# EAGLE design PHOTODIODE SENSOR 8 (EAGLE 9.6.2)
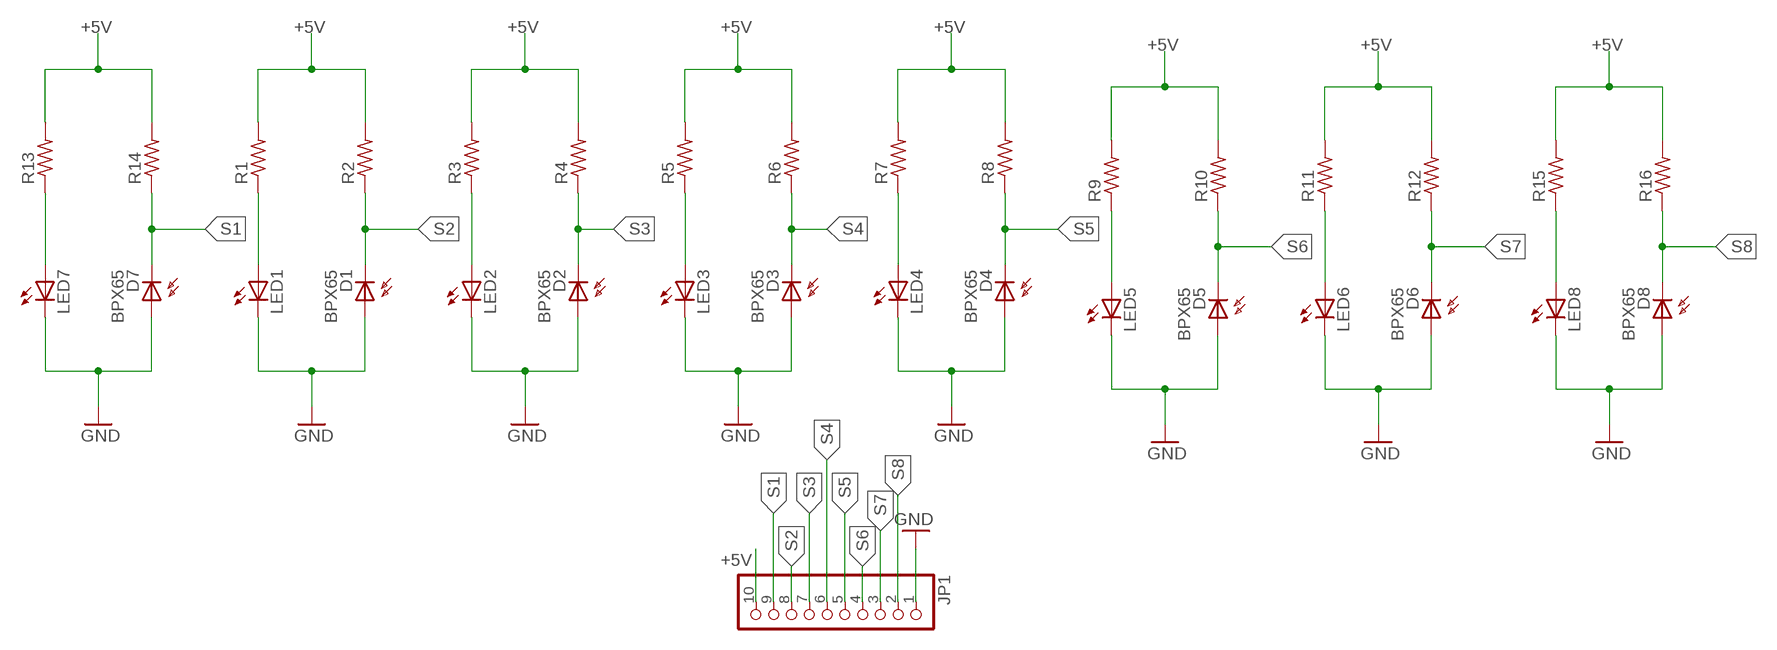
[diagram p0: schematic, sheet 1]

## Parts
D1  BPX65  [BPX65]
D2  BPX65  [BPX65]
D3  BPX65  [BPX65]
D4  BPX65  [BPX65]
D5  BPX65  [BPX65]
D6  BPX65  [BPX65]
D7  BPX65  [BPX65]
D8  BPX65  [BPX65]
JP1  PINHD-1X10  [1X10]
LED1  LED5MM  [LED5MM]
LED2  LED5MM  [LED5MM]
LED3  LED5MM  [LED5MM]
LED4  LED5MM  [LED5MM]
LED5  LED5MM  [LED5MM]
LED6  LED5MM  [LED5MM]
LED7  LED5MM  [LED5MM]
LED8  LED5MM  [LED5MM]
R1  R-US_0204/7  [0204/7]
R2  R-US_0204/7  [0204/7]
R3  R-US_0204/7  [0204/7]
R4  R-US_0204/7  [0204/7]
R5  R-US_0204/7  [0204/7]
R6  R-US_0204/7  [0204/7]
R7  R-US_0204/7  [0204/7]
R8  R-US_0204/7  [0204/7]
R9  R-US_0204/7  [0204/7]
R10  R-US_0204/7  [0204/7]
R11  R-US_0204/7  [0204/7]
R12  R-US_0204/7  [0204/7]
R13  R-US_0204/7  [0204/7]
R14  R-US_0204/7  [0204/7]
R15  R-US_0204/7  [0204/7]
R16  R-US_0204/7  [0204/7]

## Nets
+5V: JP1.10 R1.2 R2.2 R3.2 R4.2 R5.2 R6.2 R7.2 R8.2 R9.2 R10.2 R11.2 R12.2 R13.2 R14.2 R15.2 R16.2
GND: D1.A D2.A D3.A D4.A D5.A D6.A D7.A D8.A JP1.1 LED1.K(C) LED2.K(C) LED3.K(C) LED4.K(C) LED5.K(C) LED6.K(C) LED7.K(C) LED8.K(C)
N$1: LED2.A R3.1
N$2: LED3.A R5.1
N$3: LED1.A R1.1
N$4: LED4.A R7.1
N$5: LED5.A R9.1
N$6: LED6.A R11.1
N$53: LED7.A R13.1
N$54: LED8.A R15.1
S1: D7.K(C) JP1.9 R14.1
S2: D1.K(C) JP1.8 R2.1
S3: D2.K(C) JP1.7 R4.1
S4: D3.K(C) JP1.6 R6.1
S5: D4.K(C) JP1.5 R8.1
S6: D5.K(C) JP1.4 R10.1
S7: D6.K(C) JP1.3 R12.1
S8: D8.K(C) JP1.2 R16.1

## Library data of the parts
D1-D8 = opto-trans-siemens:BPX65: PHOTO DIODE; MPN: BPX65.; OC_FARNELL: 327451; OC_NEWARK: 06WX2764
JP1 = pinhead:PINHD-1X10: PIN HEADER
LED1-LED8 = led:LED: LED OSRAM: - CHIPLED LG R971, LG N971, LY N971, LG Q971, LY Q971, LO R971, LY R971 LH N974, LH R974 LS Q976, LO Q976, LY Q976 LO Q996 - Hyper CHIPLED LW Q18S LB Q993, LB Q99A, LB R99A - SideLED LS A670, LO A670, LY A670, LG A670, LP A670 LB A673, LV A673, LT A673, LW A673 LH A674 LY A675 LS A676, LA A676, LO A676, LY A676, LW A676 LS A679, LY A679, LG A679 - Hyper Micro SIDELED® LS Y876, LA Y876, LO Y876, LY Y876 LT Y87S - SmartLED LW L88C, LW L88S LB L89C, LB L89S, LG L890 LS L89K, LO L89K, LY L89K LS L896, LA L896, LO L896, LY L896 - TOPLED LS T670, LO T670, LY T670, LG T670, LP T670 LSG T670, LSP T670, LSY T670, LOP T670, LYG T670 LG T671, LOG T671, LSG T671 LB T673, LV T673, LT T673, LW T673 LH T674 LS T676, LA T676, LO T676, LY T676, LB T676, LH T676, LSB T676, LW T676 LB T67C, LV T67C, LT T67C, LS T67K, LO T67K, LY T67K, LW E67C LS E67B, LA E67B, LO E67B, LY E67B, LB E67C, LV E67C, LT E67C LW T67C LS T679, LY T679, LG T679 LS T770, LO T770, LY T770, LG T770, LP T770 LB T773, LV T773, LT T773, LW T773 LH T774 LS E675, LA E675, LY E675, LS T675 LS T776, LA T776, LO T776, LY T776, LB T776 LHGB T686 LT T68C, LB T68C - Hyper Mini TOPLED® LB M676 - Mini TOPLED Santana® LG M470 LS M47K, LO M47K, LY M47K Source: http://www.osram.convergy.de LUXEON: - LUMILED® LXK2-PW12-R00, LXK2-PW12-S00, LXK2-PW14-U00, LXK2-PW14-V00 LXK2-PM12-R00, LXK2-PM12-S00, LXK2-PM14-U00 LXK2-PE12-Q00, LXK2-PE12-R00, LXK2-PE12-S00, LXK2-PE14-T00, LXK2-PE14-U00 LXK2-PB12-K00, LXK2-PB12-L00, LXK2-PB12-M00, LXK2-PB14-N00, LXK2-PB14-P00, LXK2-PB14-Q00 LXK2-PR12-L00, LXK2-PR12-M00, LXK2-PR14-Q00, LXK2-PR14-R00 LXK2-PD12-Q00, LXK2-PD12-R00, LXK2-PD12-S00 LXK2-PH12-R00, LXK2-PH12-S00 LXK2-PL12-P00, LXK2-PL12-Q00, LXK2-PL12-R00 Source: www.luxeon.com KINGBRIGHT: KA-3528ASYC Source: www.kingbright.com
R1-R16 = rcl:R-US_: RESISTOR, American symbol; SPICEPREFIX: R

## Board
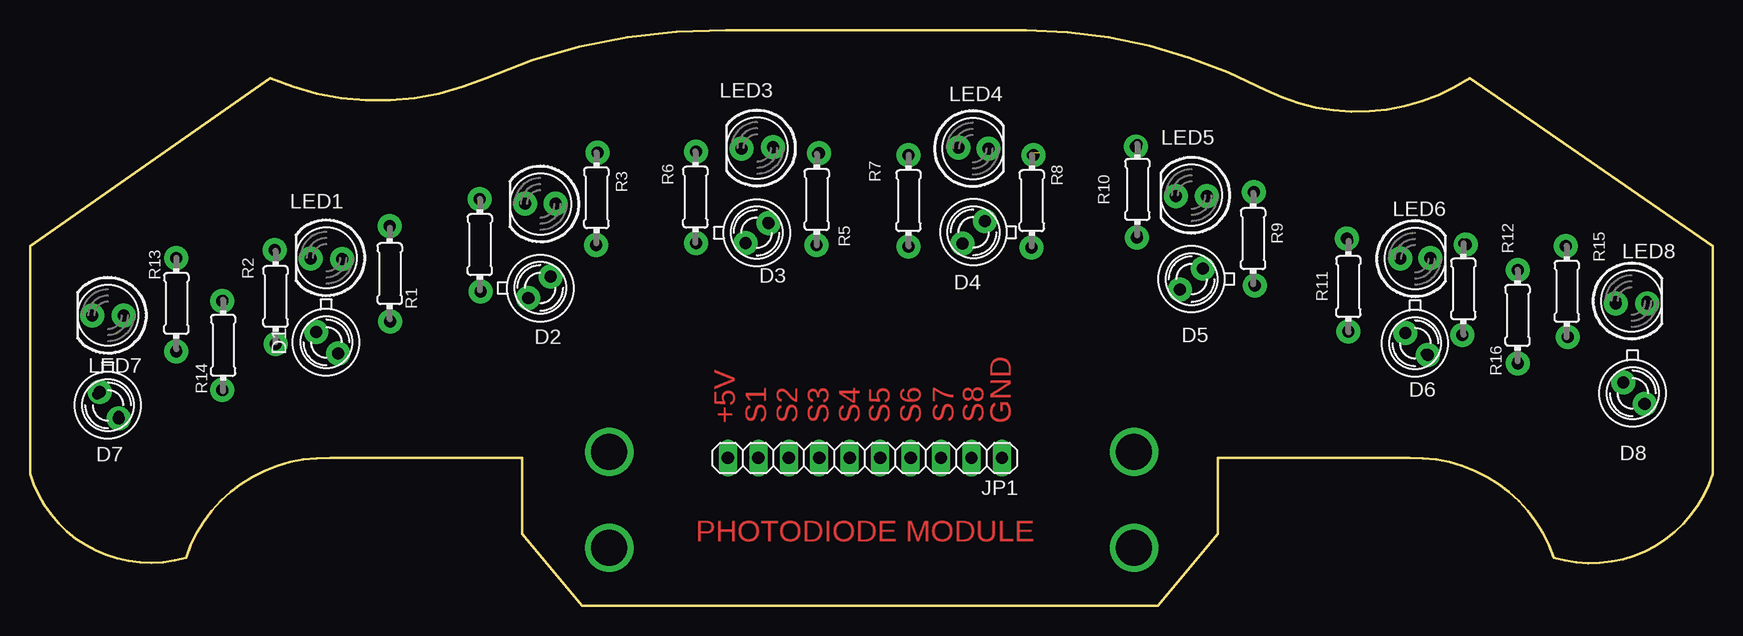
[diagram p1: board, top side]
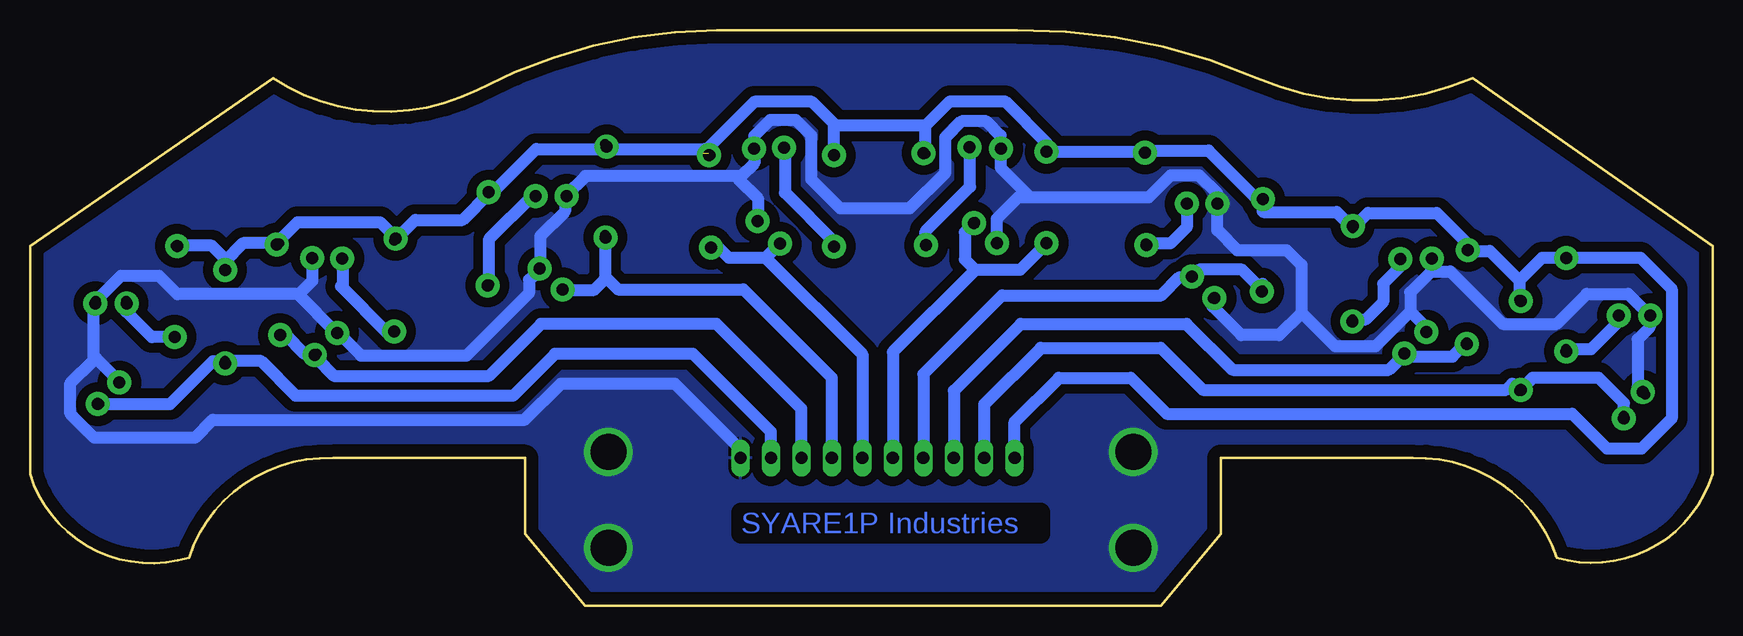
[diagram p2: board, bottom side, seen from below]

Size 140.25 x 48 mm. Coordinates in mm from the lower left corner, seen from the top.
Outline: 46,0 94,0 99,6 99,12.3 115,12.3 arc-74 127,4 arc90 140.25,11 140.25,30 120,44 arc-60 103,43 arc27 83,48 58,48 arc24 38,44 arc-48 20,44 0,30 0,11 arc90 13,4 arc-74 25,12.3 41,12.3 41,6 46,0
Copper layers (1*16): Top 0.035mm / dielectric 1.5mm / Bottom 0.035mm
Design rules "default": minimum track width 6mil, minimum drill 0.35mm, track to track 6mil, track to pad 6mil, pad to pad 6mil, via to via 6mil, smd to smd 6mil, copper to edge 40mil, drill to drill 6mil, minimum pad ring 10mil, minimum via ring 8mil, stop-mask expansion 4mil, vias tented up to drill 0mil, thermal gap 10mil

### Footprints (pad centres in the part's own frame; a part is rotated, then mirrored left to right if it is on the bottom)
BPX65 = drill 0.813 octagon: A -0.889,-0.889; K 0.889,0.889
1X10 = drill 1.016 long: 1 -11.43,0; 2 -8.89,0; 3 -6.35,0; 4 -3.81,0; 5 -1.27,0; 6 1.27,0; 7 3.81,0; 8 6.35,0; 9 8.89,0; 10 11.43,0
LED5MM = drill 0.813 octagon: A -1.27,0; K 1.27,0
0204/7 = drill 0.813 octagon: 1 -3.81,0; 2 3.81,0

### Placement (x,y rotation side)
D1  24.7,21.95 270 top
D2  42.54,26.5 0 top
D3  60.57,31.1 0 top
D4  78.64,31.11 180 top
D5  96.82,27.21 180 top
D6  115.47,21.88 270 top
D7  6.5,16.7 270 top
D8  133.6,17.7 270 top
JP1  69.6,12.3 180 top
LED1  24.71,29 180 top
LED2  42.56,33.49 180 top
LED3  60.62,38.15 180 top
LED4  78.6,38.11 0 top
LED5  96.82,34.22 180 top
LED6  115.45,28.93 0 top
LED7  6.5,24.2 180 top
LED8  133.5,25.4 0 top
R1  29.99,27.67 90 top
R2  20.47,25.77 90 top
R3  47.22,34 90 top
R4  37.5,30.1 90 top
R5  65.59,33.86 90 top
R6  55.47,34.06 90 top
R7  73.23,33.76 90 top
R8  83.51,33.76 90 top
R9  101.96,30.6 90 top
R10  92.31,34.7 90 top
R11  109.9,26.6 90 top
R12  119.48,26.4 90 top
R13  12.2,25.2 90 top
R14  16.1,21.7 90 top
R15  128.1,26.2 90 top
R16  124,24.2 90 top

### Tracks (layer width: path | path; a pad name or v marks a point on that pad's centre or on a via)
+5V  (1 unrouted)
  Bottom 1.016: R2.2 20.47,30.22 23,32.75 28.72,32.75 R1.2 31.34,32.83 37.45,32.83 37.5,32.88 R4.2 37.97,33.91 42,37.95 47.09,37.95 R3.2 47.28,37.87 R6.2 55.47,38.52 58.99,42.05 63.55,42.05 65.59,40.02 | R10.2 92.05,38.24 | 84.14,37.74 79.87,42.02 75.08,42.02 73.23,40.17 | R10.2 92.74,38.08 98.06,38.08 101.73,34.41 R9.2 104.2,32.16 108.14,32.16 R11.2 109.9,30.8 111.08,31.98 117.94,31.98 119.48,30.44 R12.2 122.48,30.21 124,28.69 R16.2 124,28.91 125.1,30.01 R15.2 | R2.2 20.3,29.58 | R7.2 72.83,37.57 | R7.2 73.23,37.77 | 83.41,37.67 R8.2 | R8.2 83.69,37.74 | 73.13,37.67 R7.2 | R7.2 73.23,40.17 | R8.2 84.01,38.07 91.87,38.07 R10.2 | R2.2 18.58,29.58 16.1,27.1 | 16.1,27.1 R14.2 | 16.1,27.1 14.19,29.01 R13.2 6.01,29.01 3.41,26.41 3.41,15.59 5.9,13.1 8.8,13.1 11.7,16 45.5,16 48.5,19 54.5,19 58.17,15.33 JP1.10 | R5.2 65.59,40.02 | 65.59,40.02 73.08,40.02 73.23,40.17
GND  (via drill 1 pad 2, 3 pad 4)
  Bottom 1.016: D1.A 23.66,22.99 25.2,24.52 | 23.44,27.86 25.2,26.11 25.2,24.52 | 23.44,27.86 LED1.K | 25.2,24.52 28.1,21.61 31.45,21.61 34.27,24.44 | 34.27,24.44 34.27,28.4 35.48,29.61 39.6,29.61 41.29,31.3 LED2.K v41.29,33.52 41.29,34.35 42.81,35.88 45.17,35.88 47.02,34.03 56.84,34.03 | D2.A 41.65,24.92 39.28,22.55 36.13,22.55 34.27,24.41 34.27,24.44 | 56.84,34.03 57.89,34.03 59.68,32.24 D3.A | 56.84,34.03 59.34,36.53 LED3.K 59.34,39.21 60.53,40.39 62.59,40.39 63.95,39.02 63.95,36.1 66.92,33.13 72.72,33.13 75.14,35.55 75.14,39.22 76.43,40.51 78.54,40.51 79.87,39.18 LED4.K 79.87,36.91 80.97,35.81 | 80.97,35.81 81.22,35.56 79.53,33.88 D4.A | 80.97,35.81 93.96,35.81 LED5.K 95.65,34.12 95.65,32.86 97.71,30.8 D5.A 98.65,27.16 98.65,26.05 103.86,20.84 112.65,20.84 D6.A 114.76,22.77 117.95,25.96 | 116.72,28.46 LED6.K 116.72,27.07 117.83,25.96 117.95,25.96 | D7.A 6.23,18.21 6.23,22.2 5.23,23.2 LED7.K 7.03,26 10.5,26 13,23.5 17.5,23.5 21.86,27.86 23.44,27.86 | 117.95,25.96 127.96,25.96 129.5,27.5 132.67,27.5 LED8.K 134.97,25.2 134.97,20.45 136.88,18.54 136.88,16 134.88,14 126.5,14 125.01,15.49 99.01,15.49 96,18.5 86.5,18.5 81.03,13.03 JP1.1 | 134.77,20.65 D8.A
  other vias: 48.29,12.81 92.04,12.81 48.29,4.81 92.04,4.81
  pour Bottom (isolate 0.813): -3.9,-3 145,-3 145,51.9 -3.9,51.9
N$1
  Bottom 1.016: LED2.A 43.83,31.56 45.2,30.19 R3.1
N$2  (via drill 1 pad 2)
  Bottom 1.016: v65.56,30.05 R5.1 65.59,31.23 61.88,34.92 LED3.A
N$3
  Bottom 1.016: LED1.A 25.98,28.32 27.45,26.85 27.45,25.32 28.91,23.86 R1.1
N$4
  Bottom 1.016: R7.1 73.23,30.33 77.33,34.43 LED4.A
N$5
  Bottom 1.016: 101.91,26.74 R9.1 101.96,30.59 98.33,34.22 LED5.A
N$6
  Bottom 1.016: 113.98,29.13 LED6.A 114.18,26.76 114.33,26.61 110.51,22.79 R11.1
N$7  (via drill 1 pad 2)
  other vias: 20.48,21.81
N$8  (via drill 1 pad 2)
  other vias: 23.84,22.82
N$9  (via drill 1 pad 2)
  other vias: 25.7,21.02
N$10  (via drill 1 pad 2)
  other vias: 23.38,28.95
N$11  (via drill 1 pad 2)
  other vias: 20.38,29.66
N$12  (via drill 1 pad 2)
  other vias: 26.03,28.89
N$13  (via drill 1 pad 2)
  other vias: 30.02,23.7
N$14  (via drill 1 pad 2)
  other vias: 29.98,31.66
N$15  (via drill 1 pad 2)
  other vias: 37.55,26.19
N$16  (via drill 1 pad 2)
  other vias: 41.52,25.64
N$17  (via drill 1 pad 2)
  other vias: 43.38,27.44
N$18  (via drill 1 pad 2)
  other vias: 43.82,33.52
N$19  (via drill 1 pad 2)
  other vias: 37.47,33.89
N$20  (via drill 1 pad 2)
  other vias: 47.18,30.06
N$21  (via drill 1 pad 2)
  other vias: 59.64,30.22
N$22  (via drill 1 pad 2)
  other vias: 61.58,31.88
N$23  (via drill 1 pad 2)
  other vias: 47.31,37.77
N$24  (via drill 1 pad 2)
  other vias: 59.3,38.09
N$25  (via drill 1 pad 2)
  other vias: 61.92,38.21
N$26  (via drill 1 pad 2)
  other vias: 55.51,30.25
N$27  (via drill 1 pad 2)
  other vias: 65.75,37.75
N$28  (via drill 1 pad 2)
  other vias: 55.51,37.85
N$29  (via drill 1 pad 2)
  other vias: 83.64,37.55
N$30  (via drill 1 pad 2)
  other vias: 83.49,29.85
N$31  (via drill 1 pad 2)
  other vias: 73.24,37.55
N$32  (via drill 1 pad 2)
  other vias: 73.24,29.95
N$33  (via drill 1 pad 2)
  other vias: 77.39,38.17
N$34  (via drill 1 pad 2)
  other vias: 79.91,38.1
N$35  (via drill 1 pad 2)
  other vias: 77.74,30.18
N$36  (via drill 1 pad 2)
  other vias: 79.59,32.08
N$37  (via drill 1 pad 2)
  other vias: 92.18,38.29
N$38  (via drill 1 pad 2)
  other vias: 98.11,34.16
N$39  (via drill 1 pad 2)
  other vias: 102.01,34.49
N$40  (via drill 1 pad 2)
  other vias: 92.28,30.69
N$41  (via drill 1 pad 2)
  other vias: 95.51,34.16
N$42  (via drill 1 pad 2)
  other vias: 95.86,26.37
N$43  (via drill 1 pad 2)
  other vias: 97.76,28.12
N$44  (via drill 1 pad 2)
  other vias: 102.11,26.69
N$45  (via drill 1 pad 2)
  other vias: 109.91,22.87
N$46  (via drill 1 pad 2)
  other vias: 116.51,20.9
N$47  (via drill 1 pad 2)
  other vias: 114.65,22.73
N$48  (via drill 1 pad 2)
  other vias: 119.41,22.55
N$49  (via drill 1 pad 2)
  other vias: 109.79,30.59
N$50  (via drill 1 pad 2)
  other vias: 114.21,28.95
N$51  (via drill 1 pad 2)
  other vias: 116.71,28.99
N$52  (via drill 1 pad 2)
  other vias: 119.69,30.09
N$53
  Bottom 1.016: R13.1 10.11,21.39 7.77,23.73 LED7.A
N$54
  Bottom 1.016: R15.1 130.1,22.39 132.23,24.52 LED8.A
N$55  (via drill 1 pad 2)
  other vias: 5.8,17.8
N$56  (via drill 1 pad 2)
  other vias: 7.4,15.6
N$57  (via drill 1 pad 2)
  other vias: 12.2,21.2
N$58  (via drill 1 pad 2)
  other vias: 16,18
N$59  (via drill 1 pad 2)
  other vias: 5.2,24.2
N$60  (via drill 1 pad 2)
  other vias: 7.8,24.2
N$61  (via drill 1 pad 2)
  other vias: 12.2,29
N$62  (via drill 1 pad 2)
  other vias: 16,25.4
N$63  (via drill 1 pad 2)
  other vias: 124,20.2
N$64  (via drill 1 pad 2)
  other vias: 124,28
N$65  (via drill 1 pad 2)
  other vias: 128,30
N$66  (via drill 1 pad 2)
  other vias: 128.2,22.4
N$67  (via drill 1 pad 2)
  other vias: 132.2,25.2
N$68  (via drill 1 pad 2)
  other vias: 134.8,25.2
N$69  (via drill 1 pad 2)
  other vias: 132.8,18.6
N$70  (via drill 1 pad 2)
  other vias: 134.6,16.8
S1
  Bottom 1.016: D7.K 7.39,16.89 9.5,19 14.99,19 R14.1 16.7,18.5 17.2,18 42.5,18 46,21.5 56,21.5 60.71,16.79 JP1.9
S2
  Bottom 1.016: R2.1 21.67,20.76 25.29,20.76 D1.K 26.99,19.66 40,19.66 43.84,23.5 57.65,23.5 63.25,17.9 JP1.8
S3
  Bottom 1.016: 37.5,26.84 R4.1 39.22,28.01 42.8,28.01 D2.K 44.43,27.38 45.94,25.87 59.22,25.87 65.79,19.3 JP1.7
S4
  Bottom 1.016: R6.1 55.27,30.05 | D3.K 62.33,31.12 62.33,28.87 61.46,28 | R6.1 55.59,30.12 | 61.46,28 57.72,28 R6.1 | 61.46,28 68.33,21.13 JP1.6
S5
  Bottom 1.016: D4.K 77.6,30.07 77.45,30.07 | R8.1 82.95,29.95 82,29 78.97,29 | JP1.5 70.87,20.96 78.91,29 78.97,29 | 77.75,29.8 D4.K | D4.K 78.97,29
S6
  Bottom 1.016: 92.67,30.9 R10.1 92.31,27.44 | 92.31,27.44 91.24,26.37 80.78,26.37 73.41,19 JP1.4 | D5.K 93.23,26.32 92.31,27.24 92.31,27.44
S7
  Bottom 1.016: R12.1 118.98,22.59 117.38,20.99 D6.K 116.36,20.59 114.92,19.15 102,19.15 97.65,23.5 83.04,23.5 75.95,16.41 JP1.3
S8
  Bottom 1.016: JP1.2 78.49,14.49 85,21 96.5,21 100,17.5 118.11,17.5 121,20.39 R16.1 125,20.39 128.58,16.81 D8.K

### Text on the board
Top: +5V | S1 | S2 | S3 | S4 | S5 | S6 | S7 | S8 | GND | PHOTODIODE MODULE
Bottom: SYARE1P Industries